# EAGLE design Board (EAGLE 9.6.2)
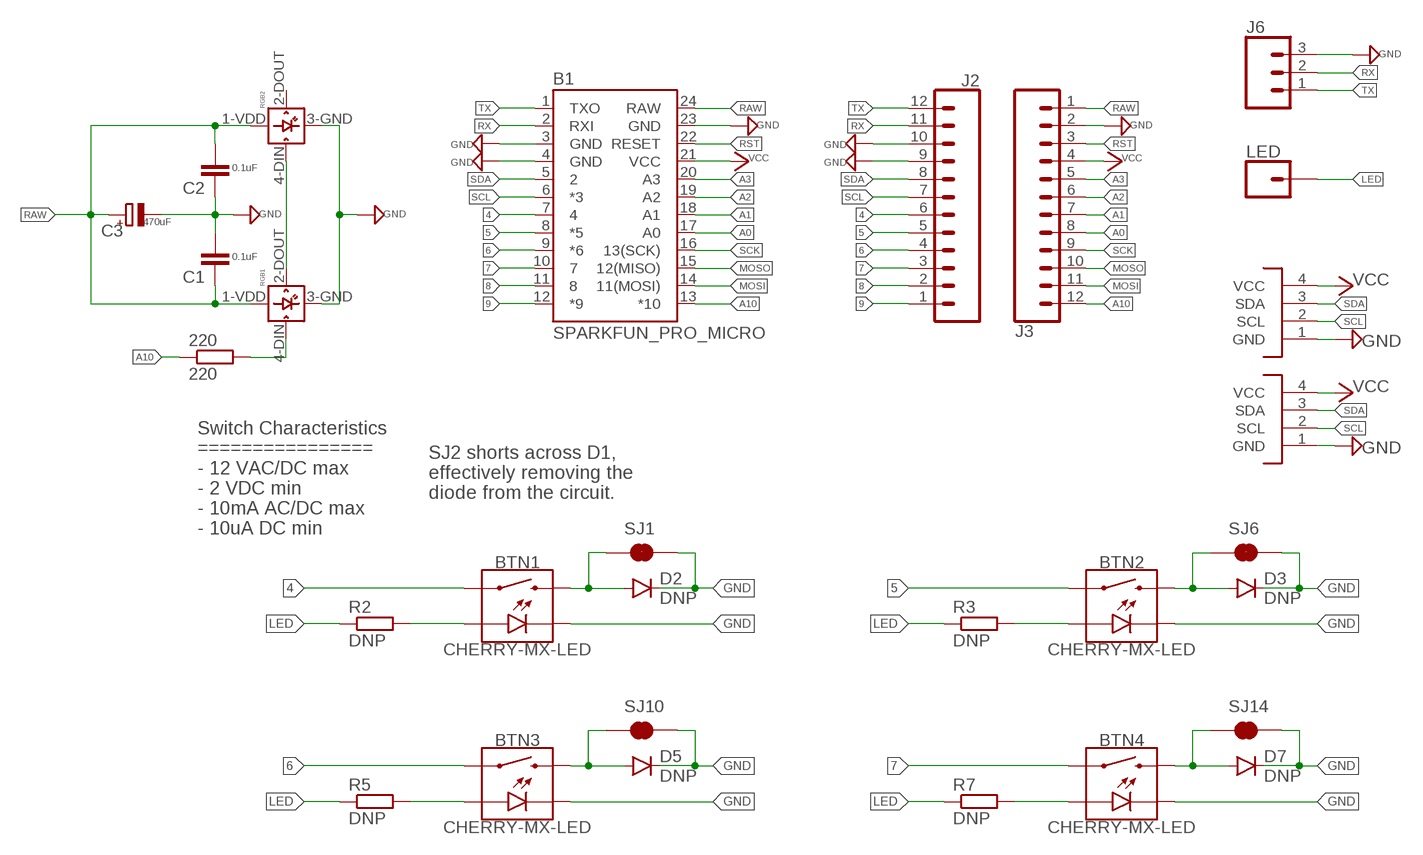
[diagram p0: schematic, sheet 1]

## Parts
220  220  R-EU_0207/10  [0207/10]
B1  SPARKFUN_PRO_MICRO  [SPARKFUN_PRO_MICRO]
BTN1  CHERRY-MX-LED  [CHERRY-MX-LED]
BTN2  CHERRY-MX-LED  [CHERRY-MX-LED]
BTN3  CHERRY-MX-LED  [CHERRY-MX-LED]
BTN4  CHERRY-MX-LED  [CHERRY-MX-LED]
C1  0.1uF  0.1UF-KIT-EZ-50V-20%  [CAP-PTH-SMALL-KIT]
C2  0.1uF  0.1UF-KIT-EZ-50V-20%  [CAP-PTH-SMALL-KIT]
C3  470uF  CPOL-EUE3.5-8  [E3,5-8]
D2  DNP  DIODEPTH-VERT-0.1  [DIODE-PTH-0.1]
D3  DNP  DIODEPTH-VERT-0.1  [DIODE-PTH-0.1]
D5  DNP  DIODEPTH-VERT-0.1  [DIODE-PTH-0.1]
D7  DNP  DIODEPTH-VERT-0.1  [DIODE-PTH-0.1]
J2  CONN_12  [1X12]
J3  CONN_12  [1X12]
J4  I2C-HEADER  [HEADER-4X1-2.54]
J5  I2C-HEADER  [HEADER-4X1-2.54]
J6  CONN_03  [1X03]
LED  CONN_01  [1X01]
R2  DNP  R-EU_0207/10  [0207/10]
R3  DNP  R-EU_0207/10  [0207/10]
R5  DNP  R-EU_0207/10  [0207/10]
R7  DNP  R-EU_0207/10  [0207/10]
RGB1  WS2812B  [WS2812B]
RGB2  WS2812B  [WS2812B]
SJ1  JUMPER-PAD-2-NC_BY_TRACENO_SILK  [PAD-JUMPER-2-NC_BY_TRACE_NO_SILK]
SJ6  JUMPER-PAD-2-NC_BY_TRACENO_SILK  [PAD-JUMPER-2-NC_BY_TRACE_NO_SILK]
SJ10  JUMPER-PAD-2-NC_BY_TRACENO_SILK  [PAD-JUMPER-2-NC_BY_TRACE_NO_SILK]
SJ14  JUMPER-PAD-2-NC_BY_TRACENO_SILK  [PAD-JUMPER-2-NC_BY_TRACE_NO_SILK]

## Nets
4: B1.7 BTN1.S1 J2.6
5: B1.8(*5) BTN2.S1 J2.5
6: B1.9(*6) BTN3.S1 J2.4
7: B1.10 BTN4.S1 J2.3
8: B1.11 J2.2
9: B1.12(*9) J2.1
A0: B1.17(A0) J3.8
A1: B1.18(A1) J3.7
A2: B1.19(A2) J3.6
A3: B1.20(A3) J3.5
A10: 220.1 B1.13(*10) J3.12
GND: B1.3(GND) B1.4(GND) B1.23(GND) BTN1.K(C) BTN2.K(C) BTN3.K(C) BTN4.K(C) C1.2 C2.1 C3.- D2.C D3.C D5.C D7.C J2.9 J2.10 J3.2 J4.1(GND) J5.1(GND) J6.3 RGB1.3-GND(GND) RGB2.3-GND(GND) SJ1.2 SJ6.2 SJ10.2 SJ14.2
LED: LED.1 R2.1 R3.1 R5.1 R7.1
MOSI: B1.14(11(MOSI)) J3.11
MOSO: B1.15(12(MISO)) J3.10
N$2: BTN1.A R2.2
N$4: 220.2 RGB1.4-DIN(DIN)
N$5: RGB1.2-DOUT(DOUT) RGB2.4-DIN(DIN)
N$6: BTN1.S2 D2.A SJ1.1
N$7: BTN2.A R3.2
N$8: BTN2.S2 D3.A SJ6.1
N$11: BTN3.A R5.2
N$12: BTN3.S2 D5.A SJ10.1
N$15: BTN4.A R7.2
N$16: BTN4.S2 D7.A SJ14.1
RAW: B1.24(RAW) C1.1 C2.2 C3.+ J3.1 RGB1.1-VDD(VDD) RGB2.1-VDD(VDD)
RST: B1.22(RESET) J3.3
RX: B1.2(RXI) J2.11 J6.2
SCK: B1.16(13(SCK)) J3.9
SCL: B1.6(*3) J2.7 J4.2(SCL) J5.2(SCL)
SDA: B1.5 J2.8 J4.3(SDA) J5.3(SDA)
TX: B1.1(TXO) J2.12 J6.1
VCC: B1.21(VCC) J3.4 J4.4(VCC) J5.4(VCC)
Unconnected: RGB2.2-DOUT(DOUT)

## Notes on the sheet
- SJ2 shorts across D1, 
  effectively removing the 
  diode from the circuit.
- Switch Characteristics
  ================
  - 12 VAC/DC max
  - 2 VDC min
  - 10mA AC/DC max
  - 10uA DC min

## Library data of the parts
220 = resistor:R-EU_: RESISTOR, European symbol
B1 = SparkFun-Boards:SPARKFUN_PRO_MICRO: SparkFun Pro Micro Atmega32U4 compatible footprint. SparkFun Products: 3.3V/8MHz <https://www.sparkfun.com/products/12587> 5V/16MHz <https://www.sparkfun.com/products/12640>
BTN1-BTN4 = cherry-temp:CHERRY-MX-LED
C1 C2 = SparkFun-Capacitors:0.1UF: 0.1µF ceramic capacitors A capacitor is a passive two-terminal electrical component used to store electrical energy temporarily in an electric field.; PROD_ID: CAP-08370
C3 = rcl:CPOL-EU: POLARIZED CAPACITOR, European symbol; SPICEPREFIX: C
D2 D3 D5 D7 = cherry-temp:DIODE: Diode These are standard reverse protection diodes and small signal diodes. SMA package can handle up to about 1A. SOD-323 can handle about 200mA. What the SOD-323 package when ordering, there are some mfgs out there that are 5-pin packages.
J2 J3 = SparkFun-Connectors:CONN_12: Multi connection point. Often used as Generic Header-pin footprint for 0.1 inch spaced/style header connections On any of the 0.1 inch spaced packages, you can populate with these: Break Away Headers - Straight <https://www.sparkfun.com/products/116> (PRT-00116) Break Away Male Headers - Right Angle <https://www.sparkfun.com/products/553> (PRT-00553) Female Headers <https://www.sparkfun.com/products/115> (PRT-00115) Break Away Headers - Machine Pin <https://www.sparkfun.com/products/117> (PRT-00117) Break Away Female Headers - Swiss Machine Pin <https://www.sparkfun.com/products/743> (PRT-00743) For SCREWTERMINALS and SPRING TERMINALS visit here: Screw Terimnals on SparkFun.com <https://www.sparkfun.com/search/results?term=Screw+Terminals> (5mm/3.5mm/2.54mm spacing) This device is also useful as a general connection point to wire up your design to another part of your project. Our various solder wires solder well into these plated through hole pads. Hook-Up Wire - Assortment (Stranded, 22 AWG) <https://www.sparkfun.com/products/11375> (PRT-11375) Hook-Up Wire - Assortment (Solid Core, 22 AWG) <https://www.sparkfun.com/products/11367> (PRT-11367) View the entire wire category on our website here <https://www.sparkfun.com/categories/141> Special notes: Molex polarized connector foot print use with SKU : PRT-08231 with associated crimp pins and housings. 1MM SMD Version SKU: PRT-10208 NOTES ON THE VARIANTS LOCK and LOCK_LONGPADS... This footprint was designed to help hold the alignment of a through-hole component (i.e. 6-pin header) while soldering it into place. You may notice that each hole has been shifted either up or down by 0.005 of an inch from it's more standard position (which is a perfectly straight line). This slight alteration caused the pins (the squares in the middle) to touch the edges of the holes. Because they are alternating, it causes a "brace" to hold the component in place. 0.005 has proven to be the perfect amount of "off-center" position when using our standard breakaway headers. Although looks a little odd when you look at the bare footprint, once you have a header in there, the alteration is very hard to notice. Also,if you push a header all the way into place, it is covered up entirely on the bottom side.
J4 J5 = Headers:I2C-HEADER
J6 = SparkFun-Connectors:CONN_03: Multi connection point. Often used as Generic Header-pin footprint for 0.1 inch spaced/style header connections On any of the 0.1 inch spaced packages, you can populate with these: Break Away Headers - Straight <https://www.sparkfun.com/products/116> (PRT-00116) Break Away Male Headers - Right Angle <https://www.sparkfun.com/products/553> (PRT-00553) Female Headers <https://www.sparkfun.com/products/115> (PRT-00115) Break Away Headers - Machine Pin <https://www.sparkfun.com/products/117> (PRT-00117) Break Away Female Headers - Swiss Machine Pin <https://www.sparkfun.com/products/743> (PRT-00743) Stackable Header - 3 Pin (Female, 0.1") <https://www.sparkfun.com/products/13875> (PRT-13875) For SCREWTERMINALS and SPRING TERMINALS visit here: Screw Terimnals on SparkFun.com <https://www.sparkfun.com/search/results?term=Screw+Terminals> (5mm/3.5mm/2.54mm spacing) This device is also useful as a general connection point to wire up your design to another part of your project. Our various solder wires solder well into these plated through hole pads. Hook-Up Wire - Assortment (Stranded, 22 AWG) <https://www.sparkfun.com/products/11375> (PRT-11375) Hook-Up Wire - Assortment (Solid Core, 22 AWG) <https://www.sparkfun.com/products/11367> (PRT-11367) View the entire wire category on our website here <https://www.sparkfun.com/categories/141> Special notes: Molex polarized connector foot print use with SKU : PRT-08232 with associated crimp pins and housings.
LED = SparkFun-Connectors:CONN_01: Single connection point. Often used as Generic Header-pin footprint for 0.1 inch spaced/style header connections On any of the 0.1 inch spaced packages, you can populate with these: Break Away Headers - Straight <https://www.sparkfun.com/products/116> (PRT-00116) Break Away Male Headers - Right Angle <https://www.sparkfun.com/products/553> (PRT-00553) Female Headers <https://www.sparkfun.com/products/115> (PRT-00115) Break Away Headers - Machine Pin <https://www.sparkfun.com/products/117> (PRT-00117) Break Away Female Headers - Swiss Machine Pin <https://www.sparkfun.com/products/743> (PRT-00743) This device is also useful as a general connection point to wire up your design to another part of your project. Our various solder wires solder well into these plated through hole pads. Hook-Up Wire - Assortment (Stranded, 22 AWG) <https://www.sparkfun.com/products/11375> (PRT-11375) Hook-Up Wire - Assortment (Solid Core, 22 AWG) <https://www.sparkfun.com/products/11367> (PRT-11367) View the entire wire category on our website here <https://www.sparkfun.com/categories/141> Special notes: SMTSO-256-ET is a "flush mount" nut for a 4-40 screw. We mostly use this on specialty testbeds; it is a nice way to connect hardware to your PCB at an adjustable hieght. Also note, the SNAP packages are for using a snappable style connector. We sell a baggie of snaps and they are also used on two LilyPad designs: Snap Assortment - 30 pack (male and female) <https://www.sparkfun.com/products/11347> (DEV-11347) LilyPad Arduino SimpleSnap <https://www.sparkfun.com/products/10941> (DEV-10941) LilyPad SimpleSnap Protoboard <https://www.sparkfun.com/products/10940> (DEV-10940)
R2 R3 R5 R7 = rcl:R-EU_: RESISTOR, European symbol; SPICEPREFIX: R
RGB1 RGB2 = Controller:WS2812B
SJ1 SJ6 SJ10 SJ14 = SparkFun-Passives:JUMPER-PAD-2-NC_BY_TRACE

## Board
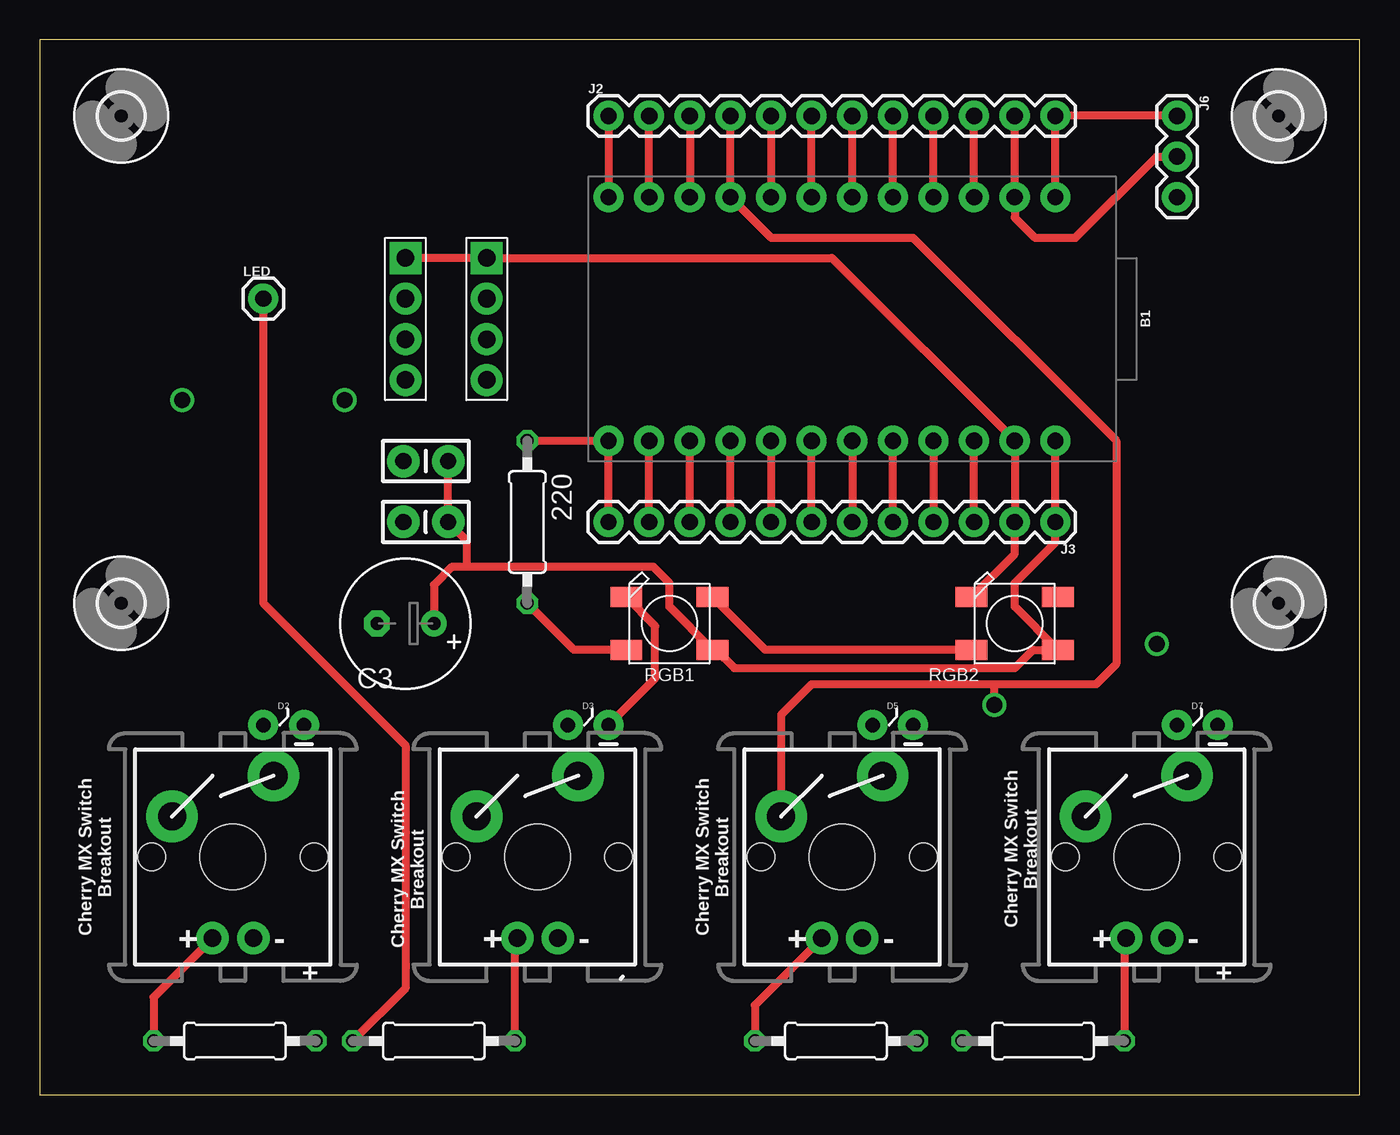
[diagram p1: board, top side]
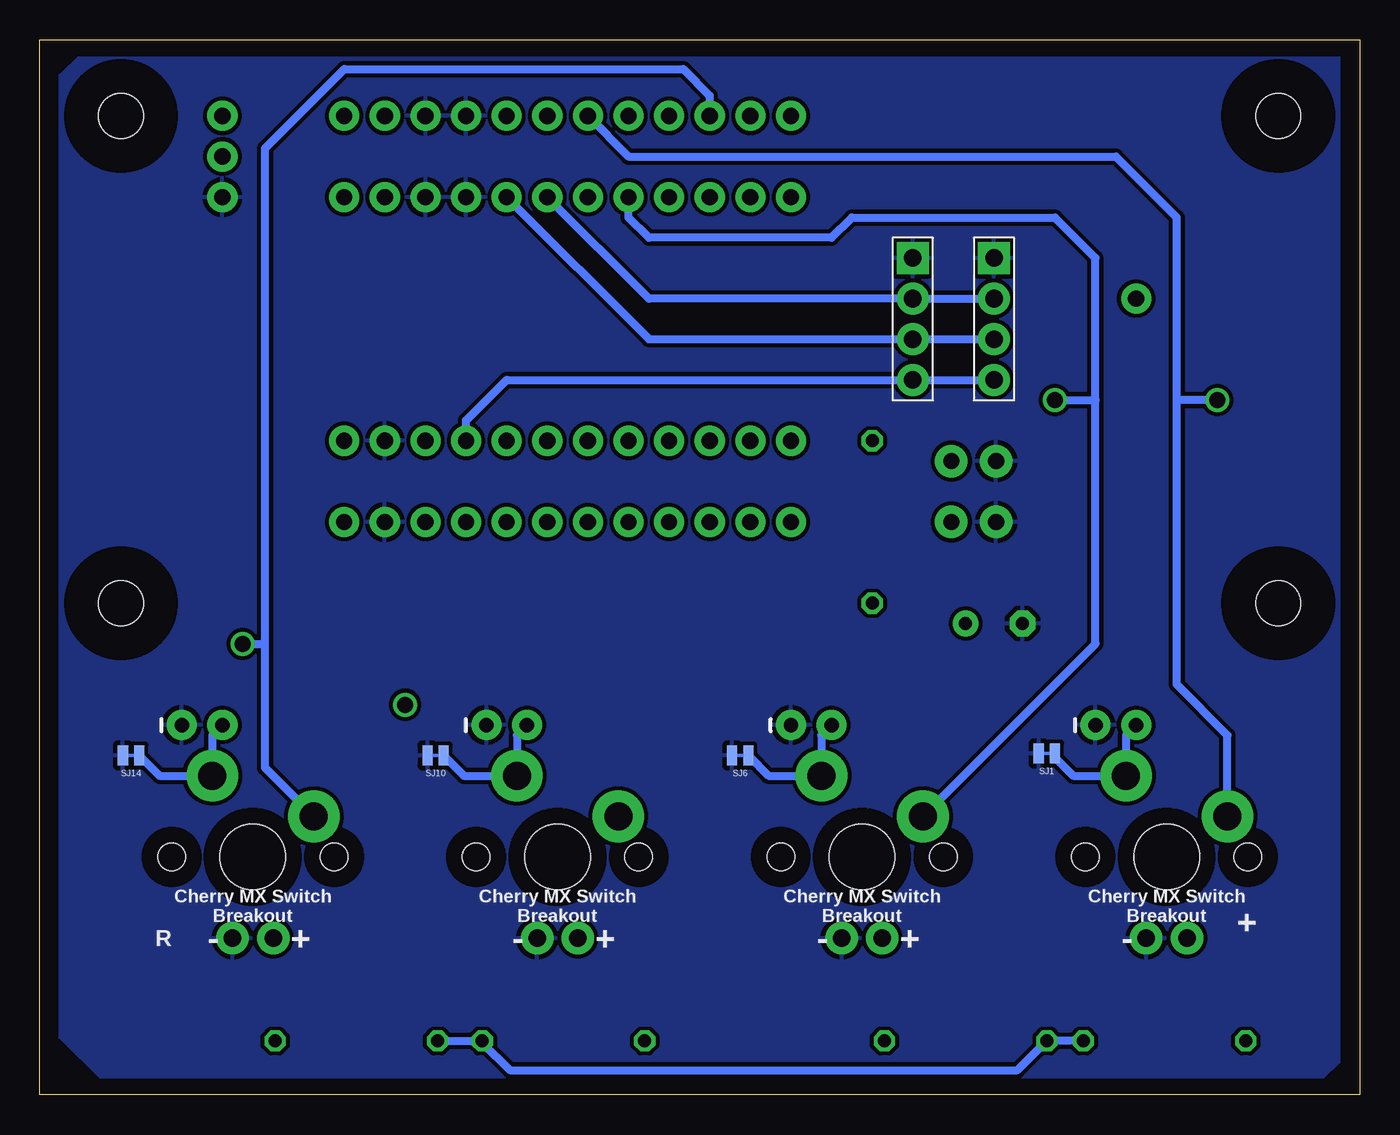
[diagram p2: board, bottom side, seen from below]

Size 82.53 x 65.96 mm. Coordinates in mm from the lower left corner, seen from the top.
Outline: 0,0 82.53,0 82.53,65.96 0,65.96 0,0
Copper layers (1*16): Top 0.035mm / dielectric 1.5mm / Bottom 0.035mm
Design rules "default *": minimum track width 20mil, minimum drill 0.35mm, track to track 10mil, track to pad 10mil, pad to pad 8mil, via to via 8mil, smd to smd 6mil, copper to edge 40mil, drill to drill 8mil, minimum pad ring 10mil, minimum via ring 8mil, stop-mask expansion 4mil, vias tented up to drill 0mil, thermal gap 12mil

### Footprints (pad centres in the part's own frame; a part is rotated, then mirrored left to right if it is on the bottom)
0207/10 = drill 0.813 octagon: 1 -5.08,0; 2 5.08,0
SPARKFUN_PRO_MICRO = drill 1.016 pad 1.88: 1 -7.62,12.7; 2 -7.62,10.16; 3 -7.62,7.62; 4 -7.62,5.08; 5 -7.62,2.54; 6 -7.62,0; 7 -7.62,-2.54; 8 -7.62,-5.08; 9 -7.62,-7.62; 10 -7.62,-10.16; 11 -7.62,-12.7; 12 -7.62,-15.24; 13 7.62,-15.24; 14 7.62,-12.7; 15 7.62,-10.16; 16 7.62,-7.62; 17 7.62,-5.08; 18 7.62,-2.54; 19 7.62,0; 20 7.62,2.54; 21 7.62,5.08; 22 7.62,7.62; 23 7.62,10.16; 24 7.62,12.7
CHERRY-MX-LED = drill 1.092 pad 2.032: A -1.27,-5.08; K 1.27,-5.08 | drill 1.753 pad 3.226: S1 -3.81,2.54; S2 2.54,5.08 | hole 4.089: 0,0 | hole 1.707: -5.08,0; 5.08,0
CAP-PTH-SMALL-KIT = drill 1.016 pad 2.032: 1 -1.397,0; 2 1.397,0
E3,5-8 = drill 0.813 pad 1.6: + -1.778,0 | drill 0.813 pad 1.6 octagon: - 1.778,0
DIODE-PTH-0.1 = drill 0.9 pad 1.88: A -1.27,0; C 1.27,0
1X12 = drill 1.016 pad 1.88: 1 0,0; 2 2.54,0; 3 5.08,0; 4 7.62,0; 5 10.16,0; 6 12.7,0; 7 15.24,0; 8 17.78,0; 9 20.32,0; 10 22.86,0; 11 25.4,0; 12 27.94,0
HEADER-4X1-2.54 = drill 1.1 pad 2 square: 1 -3.81,0 | drill 1.1 pad 2: 2 -1.27,0; 3 1.27,0; 4 3.81,0
1X03 = drill 1.016 pad 1.88: 1 0,0; 2 2.54,0; 3 5.08,0
1X01 = drill 1.016 pad 1.88: 1 0,0
WS2812B = smd 2 x 1.25: 1-VDD 2.7,-1.65; 2-DOUT 2.7,1.65; 3-GND -2.7,1.65; 4-DIN -2.7,-1.65
PAD-JUMPER-2-NC_BY_TRACE_NO_SILK = smd 0.635 x 1.27: 1 -0.508,0; 2 0.508,0
2,8 = hole 2.8: 0,0

### Placement (x,y rotation side)
220  30.48,35.81 270 top
B1  50.8,48.51 270 top
BTN1  12.07,14.86 0 top
BTN2  31.11,14.86 0 top
BTN3  50.16,14.86 0 top
BTN4  69.21,14.86 0 top
C1  24.13,35.81 180 top
C2  24.13,39.62 0 top
C3  22.86,29.46 180 top
D2  15.24,23.11 0 top
D3  34.29,23.11 0 top
D5  53.34,23.11 0 top
D7  72.39,23.11 0 top
J2  35.56,61.21 0 top
J3  63.5,35.81 180 top
J4  27.94,48.51 270 top
J5  22.86,48.51 270 top
J6  71.12,61.21 270 top
LED  13.97,49.78 0 top
R2  12.19,3.35 180 top
R3  24.64,3.35 0 top
R5  49.78,3.35 180 top
R7  62.74,3.35 0 top
RGB1  39.37,29.46 0 top
RGB2  60.96,29.46 0 top
SJ1  19.56,21.34 180 bottom
SJ6  38.73,21.21 180 bottom
SJ10  57.78,21.21 180 bottom
SJ14  76.83,21.21 180 bottom
U$1  [2,8]  5.08,61.21 0 top
U$2  [2,8]  77.47,61.21 0 top
U$3  [2,8]  77.47,30.73 0 top
U$4  [2,8]  5.08,30.73 0 top

### Tracks (layer width: path | path; a pad name or v marks a point on that pad's centre or on a via)
4  (via drill 1)
  Top 0.508: B1.7 J2.6
  Bottom 0.508: J2.6 45.72,58.67 15.24,58.67 11.43,54.86 11.43,43.43 | 11.43,43.43 11.43,25.65 8.25,22.48 BTN1.S1 | v8.89,43.43 11.43,43.43
5  (via drill 1)
  Top 0.508: J2.5 B1.8
  Bottom 0.508: 16.51,43.43 16.51,28.19 BTN2.S1 | 16.51,43.43 16.51,52.32 19.05,54.86 31.75,54.86 33.02,53.59 44.45,53.59 45.72,54.86 B1.8 | v19.05,43.43 16.51,43.43
6  (via drill 1)
  Top 0.508: J2.4 B1.9 45.72,53.59 54.61,53.59 67.31,40.89 67.31,26.92 66.04,25.65 59.69,25.65 | 59.69,25.65 48.26,25.65 46.35,23.75 BTN3.S1 | v59.69,24.38 59.69,25.65
7  (via drill 1)
  Top 0.508: J2.3 B1.10
  Bottom 0.508: J2.3 40.64,62.48 42.29,64.13 63.5,64.13 68.45,59.18 68.45,28.19 | 68.45,28.19 68.45,20.45 BTN4.S1 | v69.85,28.19 68.45,28.19
8
  Top 0.508: B1.11 J2.2
9
  Top 0.508: J2.1 B1.12
A0
  Top 0.508: B1.17 J3.8
A1
  Top 0.508: J3.7 B1.18
A2
  Top 0.508: B1.19 J3.6
A3
  Top 0.508: J3.5 B1.20
A10
  Top 0.508: J3.12 B1.13 220.1
GND
  Top 0.508: J5.1 J4.1 49.53,52.32 B1.23 J3.2 60.96,33.81 RGB2.3-GND | B1.4 J2.9 | B1.3 J2.10 | D3.C 38.48,26.03 38.48,29.3 RGB1.3-GND
  pour Bottom: 1.27,65.02 80.01,65.02 81.28,63.75 81.28,3.56 78.74,1.02 2.29,1.02 1.27,2.03
LED
  Top 0.508: LED.1 13.97,30.73 22.86,21.84 22.86,6.66 R3.1
  Bottom 0.508: R2.1 R3.1 21.39,1.52 53.14,1.52 54.86,3.25 R5.1 R7.1
MOSI
  Top 0.508: J3.11 B1.14
MOSO
  Top 0.508: J3.10 B1.15
N$2
  Top 0.508: BTN1.A 7.11,6.1 R2.2
N$4
  Top 0.508: RGB1.4-DIN 33.4,27.81 220.2
N$5
  Top 0.508: RGB2.4-DIN 45.37,27.81 RGB1.2-DOUT
N$6
  Bottom 0.508: D2.A 14.61,22.48 BTN1.S2 17.91,19.94 19.05,21.08 SJ1.1
N$7
  Top 0.508: R3.2 29.72,9.65 BTN2.A
N$8
  Bottom 0.508: SJ6.1 36.96,19.94 BTN2.S2 33.66,22.48 D3.A
N$11
  Top 0.508: BTN3.A 44.7,5.59 R5.2
N$12
  Bottom 0.508: SJ10.1 56.01,19.94 BTN3.S2 52.7,22.48 D5.A
N$15
  Top 0.508: BTN4.A 67.82,9.65 R7.2
N$16
  Bottom 0.508: SJ14.1 75.06,19.94 BTN4.S2 71.75,22.48 D7.A
RAW
  Top 0.508: 26.67,33.02 25.78,33.02 24.64,31.88 C3.+ | 26.67,33.02 38.35,33.02 39.37,32 39.37,30.51 RGB1.1-VDD 42.29,27.81 43.43,26.67 59.69,26.67 59.82,26.67 60.96,26.67 62.1,27.81 RGB2.1-VDD 60.96,30.51 60.96,32 63.5,34.54 J3.1 B1.24 | C2.2 C1.1 26.67,34.67 26.67,33.02
RST
  Top 0.508: J3.3 B1.22
RX
  Top 0.508: J2.11 B1.2 60.96,54.86 62.23,53.59 64.77,53.59 69.85,58.67 J6.2
SCK
  Top 0.508: J3.9 B1.16
SCL
  Top 0.508: B1.6 J2.7
  Bottom 0.508: J5.2 J4.2 44.45,49.78 B1.6
SDA
  Top 0.508: B1.5 J2.8
  Bottom 0.508: B1.5 44.45,47.24 J4.3 J5.3
TX
  Top 0.508: B1.1 J2.12 J6.1
VCC
  Top 0.508: B1.21 J3.4
  Bottom 0.508: B1.21 55.88,42.16 53.34,44.7 J4.4 J5.4

### Text on the board
tPlace: Cherry MX Switch / Breakout | Cherry MX Switch / Breakout | Cherry MX Switch / Breakout | Cherry MX Switch / Breakout | + | +
bPlace: Cherry MX Switch / Breakout | Cherry MX Switch / Breakout | Cherry MX Switch / Breakout | Cherry MX Switch / Breakout | + | - | + | - | + | - | + | - | R
Measures: Units in inches | Units in inches | Units in inches | Units in inches